# EAGLE design 717_ConvertionBoard_TypeG_Rev010000 (EAGLE 9.6.2)
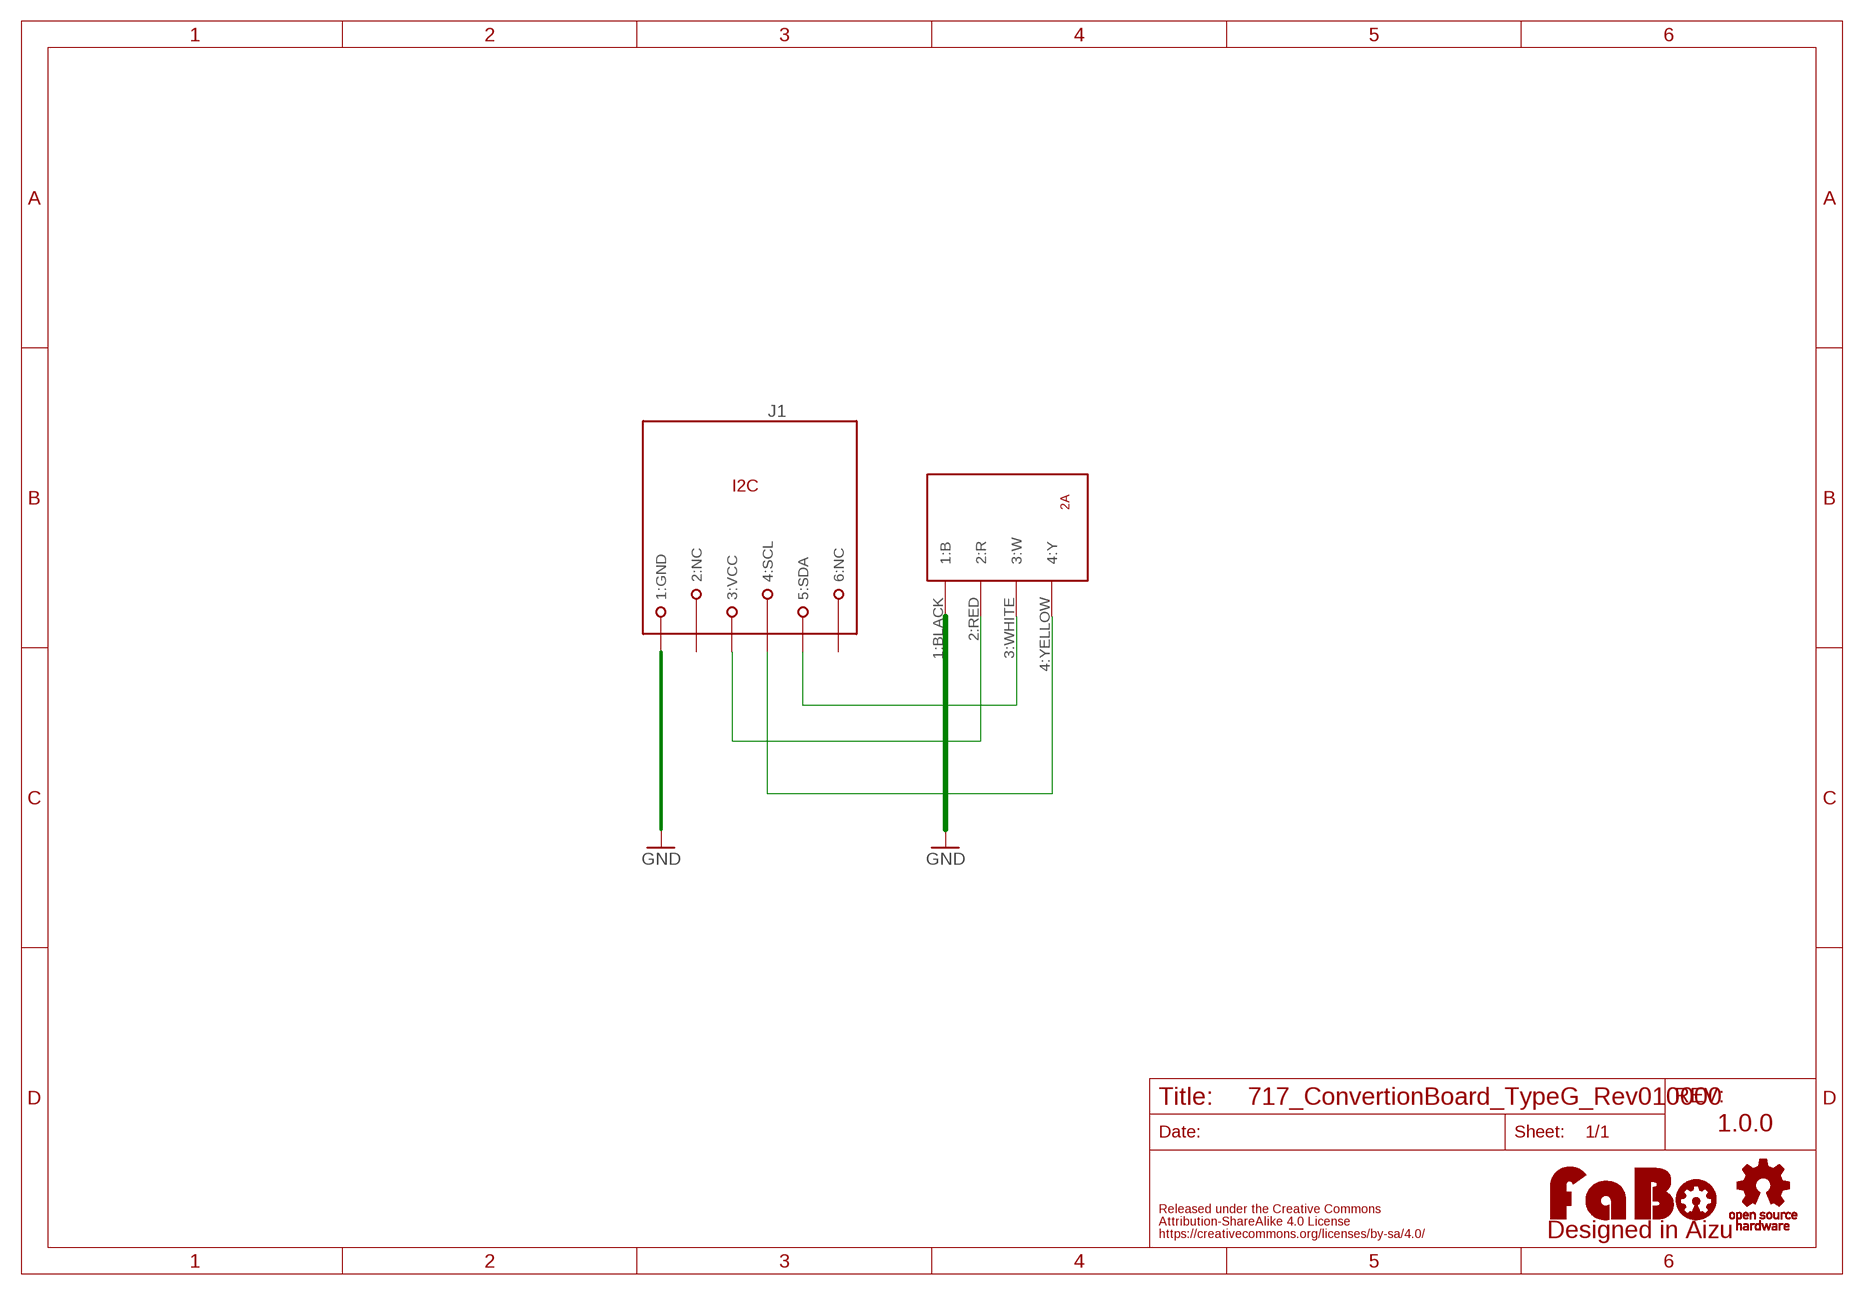
[diagram p0: schematic, sheet 1]

## Parts
J1  MODULAR-JACK-6P-RJ11_I2C  [7002-6PXC-X]
LOGO1  LOGO_FABO-M  [LOGO_FABO_M]
U$2  LOGO_OSHW-M_BOTTOM  [LOGO_OSHW_M_BOTTOM]
U$6  SG_PIN_4_SMD_SIDE  [114020164]

## Nets
GND: J1.1(1:GND) U$6.1:BLACK(1:B)
N$1: J1.3(3:VCC) U$6.2:RED(2:R)
N$2: J1.4(4:SCL) U$6.4:YELLOW(4:Y)
N$3: J1.5(5:SDA) U$6.3:WHITE(3:W)
Unconnected: J1.2(2:NC) J1.6(6:NC)

## Notes on the sheet
- 1.0.0

## Library data of the parts
J1 = FaBo-Connetor:MODULAR-JACK-6P-RJ11_I2C
LOGO1 = component:LOGO_FABO
U$2 = FaBo-etc:LOGO_OSHW
U$6 = FaBo-Connetor:SG_PIN_4_SMD_SIDE

## Board
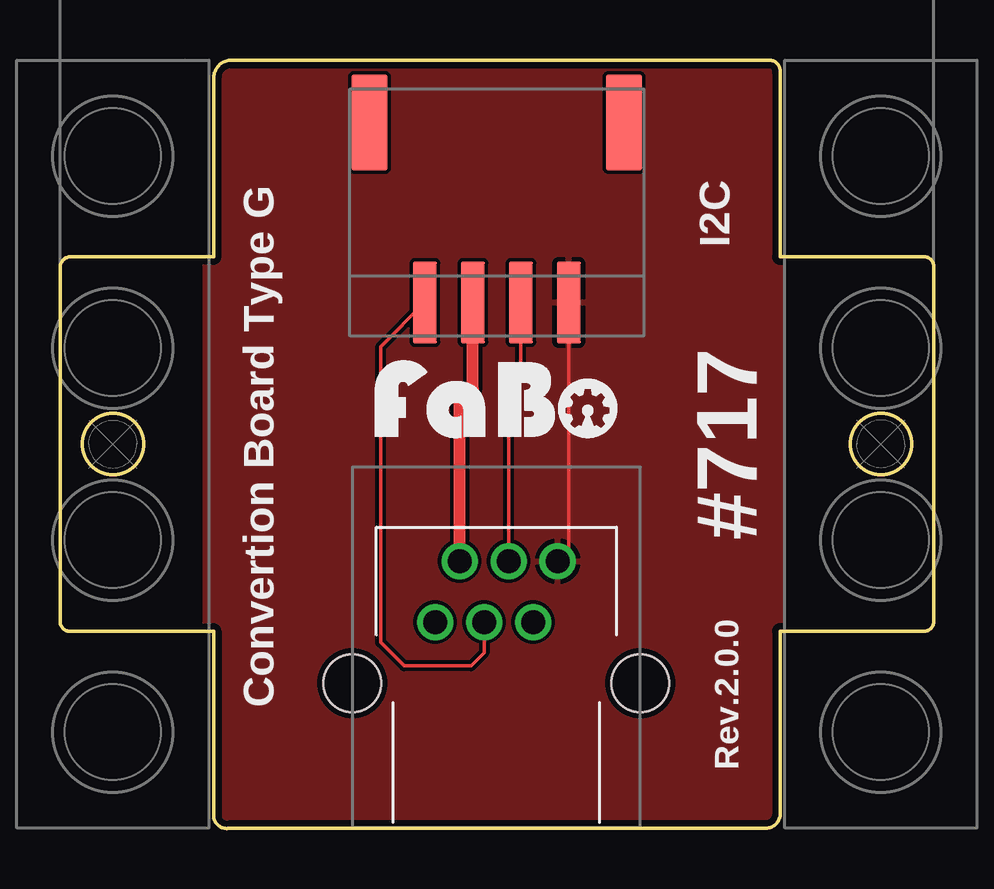
[diagram p1: board, top side]
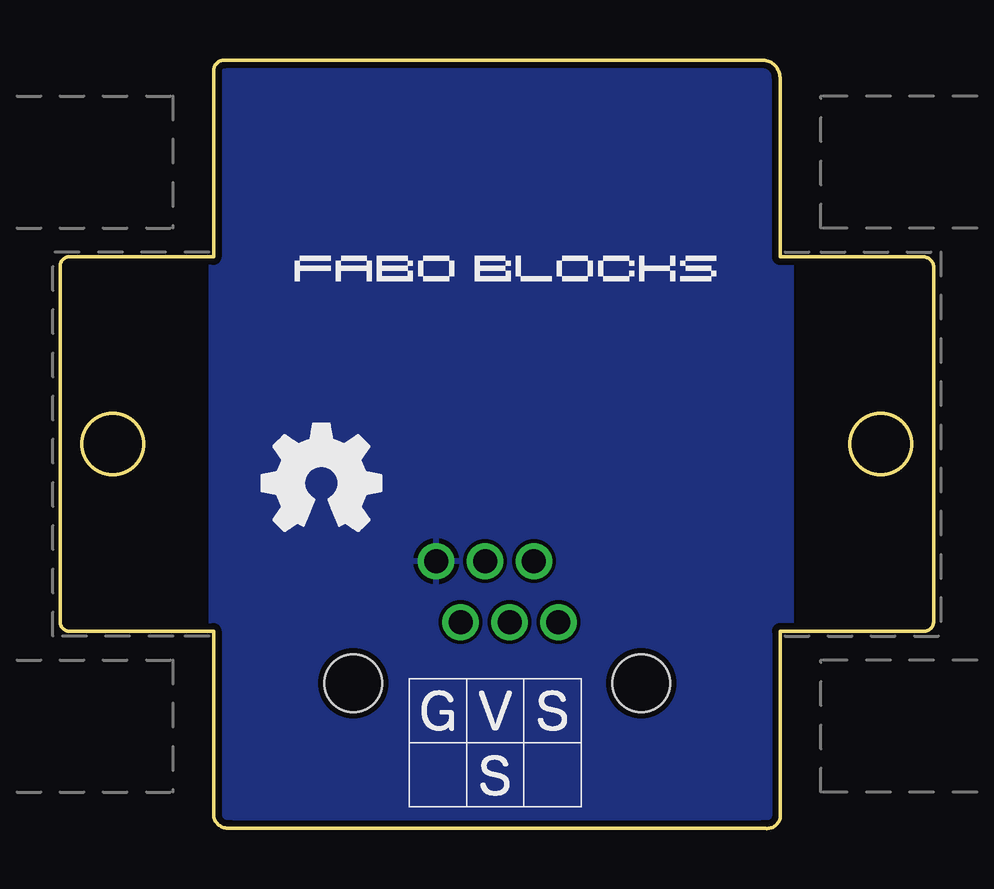
[diagram p2: board, bottom side, seen from below]

Size 36.4 x 32.02 mm. Coordinates in mm from the lower left corner, seen from the top.
Outline: 29.3,0.02 7.1,0.02 arc-90 6.4,0.42 6.4,8.22 0.4,8.22 arc-90 0,8.62 0,23.32 arc-90 0.4,23.82 6.4,23.82 6.4,31.22 arc-90 7.1,32.02 29.5,32.02 arc-99 30,31.52 30,23.82 36,23.82 arc-90 36.4,23.42 36.4,8.62 arc-90 36,8.22 30,8.22 30,0.52 arc-90 29.3,0.02
Outline: circle at 34.2,16.02 radius 1.27
Outline: circle at 2.2,16.02 radius 1.27
Copper layers (1*16): Top 0.035mm / dielectric 1.6mm / Bottom 0.035mm
Design rules "PCBway": minimum track width 6mil, minimum drill 12mil, track to track 6mil, track to pad 6mil, pad to pad 6mil, via to via 6mil, smd to smd 6mil, copper to edge 10mil, drill to drill 10mil, minimum pad ring 10mil, minimum via ring 6mil, stop-mask expansion 2mil, vias tented up to drill 100mil, thermal gap 8mil

### Footprints (pad centres in the part's own frame; a part is rotated, then mirrored left to right if it is on the bottom)
7002-6PXC-X = drill 1: 1 2.55,5.08; 2 1.53,2.54; 3 0.51,5.08; 4 -0.51,2.54; 5 -1.53,5.08; 6 -2.55,2.54 | hole 2.4: -6,0; 6,0
114020164 = smd 1 x 3.4: 1:BLACK -3,3.75; 2:RED -1,3.75; 3:WHITE 1,3.75; 4:YELLOW 3,3.75 | smd 1.5 x 4: 5:L -5.3,-3.75; 6:R 5.3,-3.75

### Placement (x,y rotation side)
J1  18.18,6.06 0 top
LOGO1  18.18,15.89 0 top
U$2  25.5,14.4 0 top
U$3  [4-1BLOCK]  2.2,16.02 0 top
U$4  [4-1BLOCK]  34.2,16.02 180 top
U$6  18.2,25.67 180 top

### Tracks (layer width: path | path; a pad name or v marks a point on that pad's centre or on a via)
GND
  Top 0.152: U$6.1:BLACK 21.2,11.6 J1.1
  pour Bottom (isolate 0.152, rank 6): 5.9,0.02 30.14,0.02 30.14,33.09 5.9,33.09
  pour Top (isolate 0.152): 6,0.02 30.14,0.02 30.14,32.69 6,32.69
N$1
  Top 0.152: J1.3 18.69,18.35 19.2,18.85 U$6.2:RED
N$2
  Top 0.152: J1.4 17.67,7.32 17.13,6.78 14.33,6.78 13.36,7.75 13.36,20.07 U$6.4:YELLOW
N$3
  Top 0.508: J1.5 16.65,17.77 17.2,18.32 U$6.3:WHITE

### Text on the board
tPlace: I2C | Convertion Board Type G | #717 | Rev.2.0.0
Document: 717 ConvertionBoard Type G / 2023/01/23
tDocu: PS1740P02E